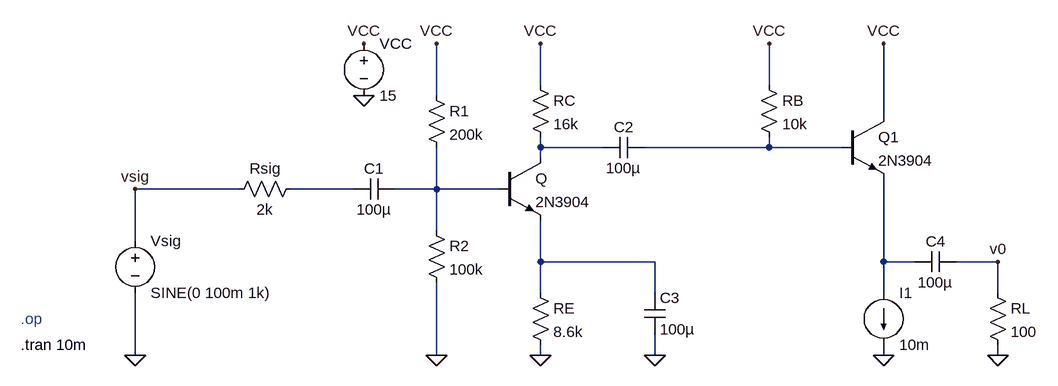
[diagram p0: schematic hw2_112021117_falseeeeeee.asc]
hw2_112021117_falseeeeeee.asc, the LTspice schematic file:
Version 4.1
SHEET 1 1332 756
WIRE 560 -80 560 -144
WIRE 912 -80 912 -144
WIRE 400 -64 400 -144
WIRE 1088 -32 1088 -144
WIRE 560 16 560 0
WIRE 656 16 560 16
WIRE 912 16 912 0
WIRE 912 16 720 16
WIRE 1024 16 912 16
WIRE 560 32 560 16
WIRE 96 80 -64 80
WIRE 272 80 176 80
WIRE 400 80 400 16
WIRE 400 80 336 80
WIRE 496 80 400 80
WIRE 400 144 400 80
WIRE -64 160 -64 80
WIRE 560 192 560 128
WIRE 736 192 560 192
WIRE 1088 192 1088 64
WIRE 1136 192 1088 192
WIRE 1264 192 1200 192
WIRE 560 240 560 192
WIRE 736 240 736 192
WIRE 1088 240 1088 192
WIRE 1264 240 1264 192
WIRE -64 336 -64 240
WIRE 400 336 400 224
WIRE 560 336 560 320
WIRE 736 336 736 304
WIRE 1088 336 1088 320
WIRE 1264 336 1264 320
FLAG -64 336 0
FLAG 400 336 0
FLAG 560 336 0
FLAG 736 336 0
FLAG 288 -64 0
FLAG 560 -144 VCC
FLAG 400 -144 VCC
FLAG 288 -144 VCC
FLAG -64 80 vsig
FLAG 912 -144 VCC
FLAG 1088 -144 VCC
FLAG 1264 336 0
FLAG 1088 336 0
FLAG 1264 192 v0
SYMBOL voltage -64 144 R0
WINDOW 123 0 0 Left 0
WINDOW 39 0 0 Left 0
SYMATTR InstName Vsig
SYMATTR Value SINE(0 100m 1k)
SYMBOL res 192 64 R90
WINDOW 0 0 56 VBottom 2
WINDOW 3 32 56 VTop 2
SYMATTR InstName Rsig
SYMATTR Value 2k
SYMBOL cap 336 64 R90
WINDOW 0 0 32 VBottom 2
WINDOW 3 32 32 VTop 2
SYMATTR InstName C1
SYMATTR Value 100µ
SYMBOL res 384 -80 R0
SYMATTR InstName R1
SYMATTR Value 200k
SYMBOL res 384 128 R0
SYMATTR InstName R2
SYMATTR Value 100k
SYMBOL npn 496 32 R0
SYMATTR InstName Q
SYMATTR Value 2N3904
SYMBOL res 544 -96 R0
SYMATTR InstName RC
SYMATTR Value 16k
SYMBOL res 544 224 R0
SYMATTR InstName RE
SYMATTR Value 8.6k
SYMBOL cap 720 304 M180
WINDOW 0 24 56 Left 2
WINDOW 3 24 8 Left 2
SYMATTR InstName C3
SYMATTR Value 100µ
SYMBOL cap 720 0 R90
WINDOW 0 0 32 VBottom 2
WINDOW 3 32 32 VTop 2
SYMATTR InstName C2
SYMATTR Value 100µ
SYMBOL res 1248 224 R0
SYMATTR InstName RL
SYMATTR Value 100
SYMBOL voltage 288 -160 R0
SYMATTR InstName VCC
SYMATTR Value 15
SYMBOL res 896 -96 R0
SYMATTR InstName RB
SYMATTR Value 10k
SYMBOL npn 1024 -32 R0
SYMATTR InstName Q1
SYMATTR Value 2N3904
SYMBOL cap 1200 176 R90
WINDOW 0 0 32 VBottom 2
WINDOW 3 32 32 VTop 2
SYMATTR InstName C4
SYMATTR Value 100µ
SYMBOL current 1088 240 R0
SYMATTR InstName I1
SYMATTR Value 10m
TEXT -240 320 Left 2 !.tran 10m
TEXT -240 280 Left 2 ;.op

The netlist it stands for:
* hw2_112021117_falseeeeeee.asc
Vsig vsig 0 SINE(0 100m 1k)
Rsig N003 vsig 2k
C1 N004 N003 100µ
R1 VCC N004 200k
R2 N004 0 100k
Q N001 N004 N005 0 2N3904
RC VCC N001 16k
RE N005 0 8.6k
C3 0 N005 100µ
C2 N002 N001 100µ
RL v0 0 100
VCC VCC 0 15
RB VCC N002 10k
Q1 VCC N002 N006 0 2N3904
C4 v0 N006 100µ
I1 N006 0 10m
.model NPN NPN
.model PNP PNP
.lib standard.bjt
.tran 10m
* .op
.backanno
.end